# Altium schematic sheet IO.SchDoc
size A
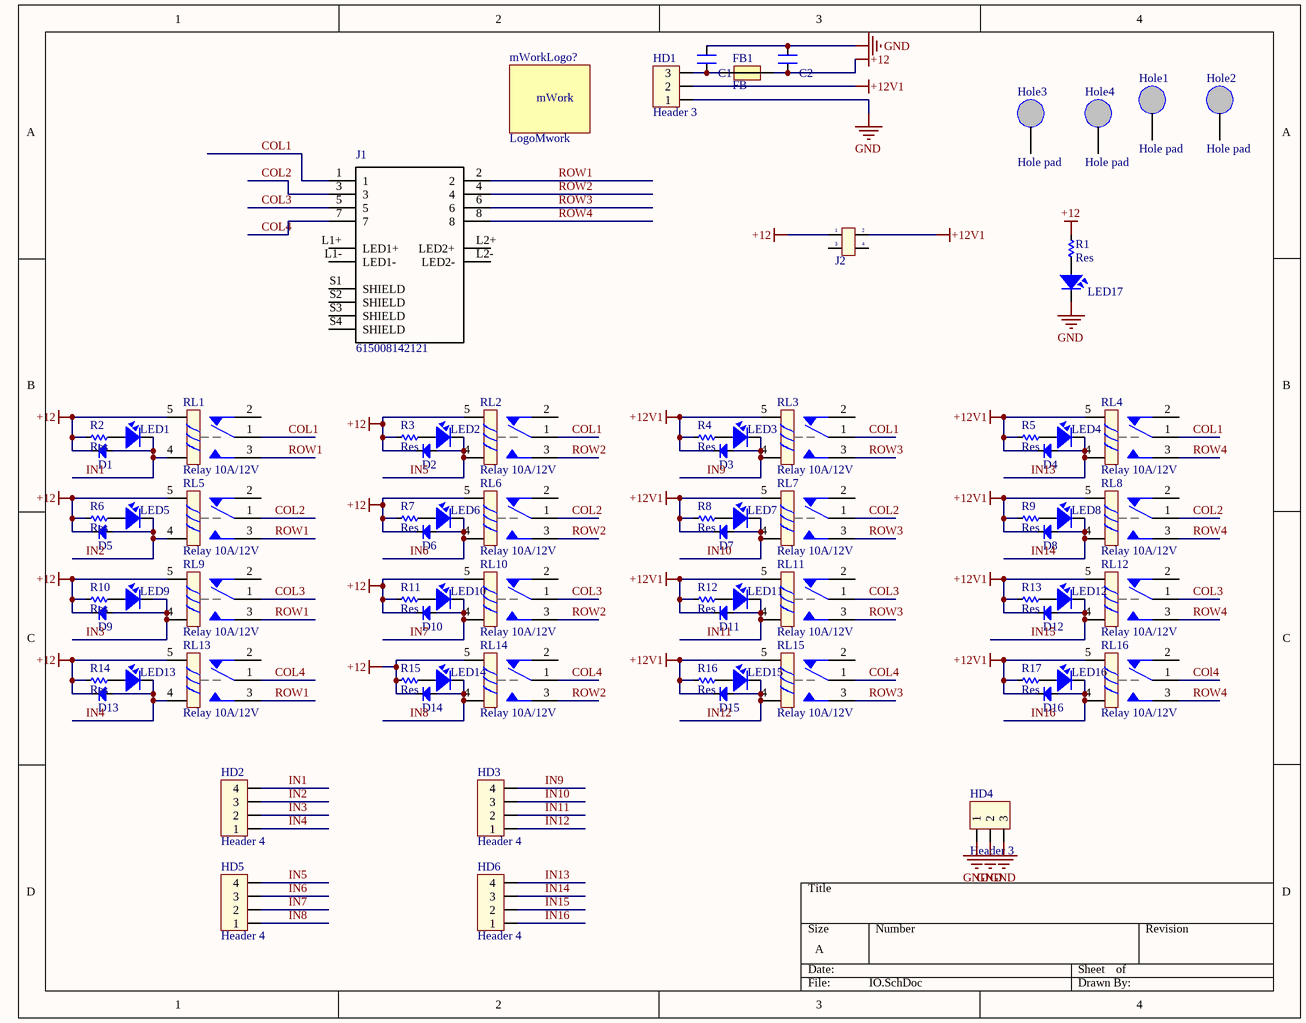
[diagram p0: IO.SchDoc]

## Parts
C1  CN  [CN-SMD-0805]  (value not drawn)
C2  CN  [CN-SMD-0805]  (value not drawn)
D1  Diode  [DIO-1AN]  (value not drawn)
D2  Diode  [DIO-1AN]  (value not drawn)
D3  Diode  [DIO-1AN]  (value not drawn)
D4  Diode  [DIO-1AN]  (value not drawn)
D5  Diode  [DIO-1AN]  (value not drawn)
D6  Diode  [DIO-1AN]  (value not drawn)
D7  Diode  [DIO-1AN]  (value not drawn)
D8  Diode  [DIO-1AN]  (value not drawn)
D9  Diode  [DIO-1AN]  (value not drawn)
D10  Diode  [DIO-1AN]  (value not drawn)
D11  Diode  [DIO-1AN]  (value not drawn)
D12  Diode  [DIO-1AN]  (value not drawn)
D13  Diode  [DIO-1AN]  (value not drawn)
D14  Diode  [DIO-1AN]  (value not drawn)
D15  Diode  [DIO-1AN]  (value not drawn)
D16  Diode  [DIO-1AN]  (value not drawn)
FB1  FB  [Capacitor_805]
HD1  Header 3  [HED3T]
HD2  Header 4  [HED4T]
HD3  Header 4  [HED4T]
HD4  Header 3  [HED3T]
HD5  Header 4  [HED4T]
HD6  Header 4  [HED4T]
Hole1  Hole pad  [HolePad1]
Hole2  Hole pad  [HolePad1]
Hole3  Hole pad  [HolePad1]
Hole4  Hole pad  [HolePad1]
J1  615008142121  [RJ45_8P8C]
J2  Jumper 2x2  [JP2X2]  (value not drawn)
LED1  LED  [LED-3MM-RED]  (value not drawn)
LED2  LED  [LED-3MM-RED]  (value not drawn)
LED3  LED  [LED-3MM-RED]  (value not drawn)
LED4  LED  [LED-3MM-RED]  (value not drawn)
LED5  LED  [LED-3MM-RED]  (value not drawn)
LED6  LED  [LED-3MM-RED]  (value not drawn)
LED7  LED  [LED-3MM-RED]  (value not drawn)
LED8  LED  [LED-3MM-RED]  (value not drawn)
LED9  LED  [LED-3MM-RED]  (value not drawn)
LED10  LED  [LED-3MM-RED]  (value not drawn)
LED11  LED  [LED-3MM-RED]  (value not drawn)
LED12  LED  [LED-3MM-RED]  (value not drawn)
LED13  LED  [LED-3MM-RED]  (value not drawn)
LED14  LED  [LED-3MM-RED]  (value not drawn)
LED15  LED  [LED-3MM-RED]  (value not drawn)
LED16  LED  [LED-3MM-RED]  (value not drawn)
LED17  LED  [LED-3MM-RED]  (value not drawn)
mWorkLogo?  LogoMwork  [LogoMwork15*6]
R1  Res  [RES-1/4WD]
R2  Res  [RES-1/4WD]
R3  Res  [RES-1/4WD]
R4  Res  [RES-1/4WD]
R5  Res  [RES-1/4WD]
R6  Res  [RES-1/4WD]
R7  Res  [RES-1/4WD]
R8  Res  [RES-1/4WD]
R9  Res  [RES-1/4WD]
R10  Res  [RES-1/4WD]
R11  Res  [RES-1/4WD]
R12  Res  [RES-1/4WD]
R13  Res  [RES-1/4WD]
R14  Res  [RES-1/4WD]
R15  Res  [RES-1/4WD]
R16  Res  [RES-1/4WD]
R17  Res  [RES-1/4WD]
RL1  Relay 10A/12V  [HF46F-G]
RL2  Relay 10A/12V  [HF46F-G]
RL3  Relay 10A/12V  [HF46F-G]
RL4  Relay 10A/12V  [HF46F-G]
RL5  Relay 10A/12V  [HF46F-G]
RL6  Relay 10A/12V  [HF46F-G]
RL7  Relay 10A/12V  [HF46F-G]
RL8  Relay 10A/12V  [HF46F-G]
RL9  Relay 10A/12V  [HF46F-G]
RL10  Relay 10A/12V  [HF46F-G]
RL11  Relay 10A/12V  [HF46F-G]
RL12  Relay 10A/12V  [HF46F-G]
RL13  Relay 10A/12V  [HF46F-G]
RL14  Relay 10A/12V  [HF46F-G]
RL15  Relay 10A/12V  [HF46F-G]
RL16  Relay 10A/12V  [HF46F-G]

## Nets
+12: C2.2 D1.2(K) D2.2(K) D5.2(K) D6.2(K) D9.2(K) D10.2(K) D13.2(K) D14.2(K) FB1.2 J2.1 R1.2 R2.2 R3.2 R6.2 R7.2 R10.2 R11.2 R14.2 R15.2 RL1.5 RL2.5 RL5.5 RL6.5 RL9.5 RL10.5 RL13.5 RL14.5
+12V1: D3.2(K) D4.2(K) D7.2(K) D8.2(K) D11.2(K) D12.2(K) D15.2(K) D16.2(K) HD1.2 J2.2 R4.2 R5.2 R8.2 R9.2 R12.2 R13.2 R16.2 R17.2 RL3.5 RL4.5 RL7.5 RL8.5 RL11.5 RL12.5 RL15.5 RL16.5
GND: C1.1 C2.1 HD1.1 HD4.1 HD4.2 HD4.3 LED17.2
COL1: J1.1 RL1.1 RL2.1 RL3.1 RL4.1
COL2: J1.3 RL5.1 RL6.1 RL7.1 RL8.1
COL3: J1.5 RL9.1 RL10.1 RL11.1 RL12.1
COL4: J1.7 RL13.1 RL14.1 RL15.1 RL16.1
IN1: D1.1(A) HD2.4 LED1.2 RL1.4
IN2: D5.1(A) HD2.3 LED5.2 RL5.4
IN3: D9.1(A) HD2.2 LED9.2 RL9.4
IN4: D13.1(A) HD2.1 LED13.2 RL13.4
IN5: D2.1(A) HD5.4 LED2.2 RL2.4
IN6: D6.1(A) HD5.3 LED6.2 RL6.4
IN7: D10.1(A) HD5.2 LED10.2 RL10.4
IN8: D14.1(A) HD5.1 LED14.2 RL14.4
IN9: D3.1(A) HD3.4 LED3.2 RL3.4
IN10: D7.1(A) HD3.3 LED7.2 RL7.4
IN11: D11.1(A) HD3.2 LED11.2 RL11.4
IN12: D15.1(A) HD3.1 LED15.2 RL15.4
IN13: D4.1(A) HD6.4 LED4.2 RL4.4
IN14: D8.1(A) HD6.3 LED8.2 RL8.4
IN15: D12.1(A) HD6.2 LED12.2 RL12.4
IN16: D16.1(A) HD6.1 LED16.2 RL16.4
ROW1: J1.2 RL1.3 RL5.3 RL9.3 RL13.3
ROW2: J1.4 RL2.3 RL6.3 RL10.3 RL14.3
ROW3: J1.6 RL3.3 RL7.3 RL11.3 RL15.3
ROW4: J1.8 RL4.3 RL8.3 RL12.3 RL16.3
NetC1_2: C1.2 FB1.1 HD1.3
NetLED1_1: LED1.1 R2.1
NetLED2_1: LED2.1 R3.1
NetLED3_1: LED3.1 R4.1
NetLED4_1: LED4.1 R5.1
NetLED5_1: LED5.1 R6.1
NetLED6_1: LED6.1 R7.1
NetLED7_1: LED7.1 R8.1
NetLED8_1: LED8.1 R9.1
NetLED9_1: LED9.1 R10.1
NetLED10_1: LED10.1 R11.1
NetLED11_1: LED11.1 R12.1
NetLED12_1: LED12.1 R13.1
NetLED13_1: LED13.1 R14.1
NetLED14_1: LED14.1 R15.1
NetLED15_1: LED15.1 R16.1
NetLED16_1: LED16.1 R17.1
NetLED17_1: LED17.1 R1.1

Not connected (* = marked no-connect by the designer): Hole1 1; Hole2 1; Hole3 1; Hole4 1; J1 L1+(LED1+) L1-(LED1-) L2+(LED2+) L2-(LED2-) S1(SHIELD) S2(SHIELD) S3(SHIELD) S4(SHIELD); J2 3 4; RL1 2; RL2 2; RL3 2; RL4 2; RL5 2; RL6 2; RL7 2; RL8 2; RL9 2; RL10 2; RL11 2; RL12 2; RL13 2; RL14 2; RL15 2; RL16 2

## Notes on the sheet
- (in symbol LogoMwork) mWork

## Library data of the parts
C1 C2 = CN: Value: 33pF
D1-D16 = Diode: Default Diode; Code - JEDEC: DO-214-AB; Value: 1N5007; Published: 8-Jun-2000; Revision: July-2002: Re-released for DXP Platform.; Publisher: Altium Limited
HD1 HD4 = Hed3: Header 3 (Green); Value: Header 3
HD2 HD3 HD5 HD6 = Hed4: Header 4 (Green); Value: Header 4
J1 = RJ45_8P8C: Conn, Rj45 Jack, Shld, 1port, 8p8c, Cat5; MF: WÃ¼rth Elektronik; MP: 615008142121; Price: None; Availability: Unavailable; SnapEDA_Link: https://www.snapeda.com/parts/615008142121/W%C3%BCrth%20Elektronik/view-part/1118273/?ref=snap; Package: None; Value: *
J2 = JP2x2: Value: JP 2x2
LED1-LED17 = LED: LED Single colour Green and Red; Value: LED 3 ly Single Colour
R1-R17 = Res: Manufacturer: Generic Components; Class: Passive; SubClass: R; Published: 08/06/2000; Publisher: Altium Hobart Technology Centre
RL1-RL16 = Relay 5: Relay SPDT,10A - 12VDC 5 Pin; Value: Relay SPDT, 10A, 12V